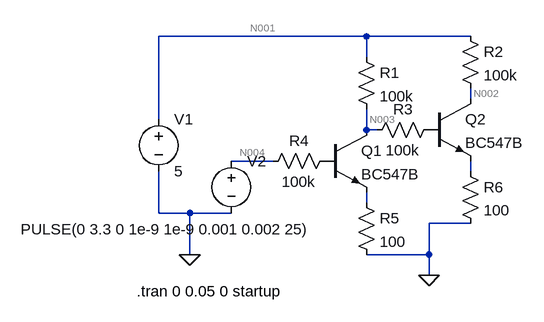
[diagram p0: schematic 3V3_to_5V_Converter_NPN_BJT.asc]
3V3_to_5V_Converter_NPN_BJT.asc, the LTspice schematic file:
Version 4
SHEET 1 880 680
WIRE 176 -16 -144 -16
WIRE 336 -16 176 -16
WIRE 176 16 176 -16
WIRE 336 80 336 64
WIRE -144 112 -144 -16
WIRE 176 128 176 96
WIRE 192 128 176 128
WIRE 32 176 -32 176
WIRE 336 192 336 176
WIRE 176 240 176 224
WIRE -144 256 -144 192
WIRE -96 256 -144 256
WIRE -32 256 -96 256
WIRE 336 272 272 272
WIRE -96 320 -96 256
WIRE 272 320 272 272
WIRE 272 320 176 320
WIRE 272 352 272 320
FLAG 272 352 0
FLAG -96 320 0
SYMBOL npn 112 128 R0
SYMATTR InstName Q1
SYMATTR Value BC547B
SYMBOL res 160 0 R0
SYMATTR InstName R1
SYMATTR Value 100k
SYMBOL res 320 -32 R0
SYMATTR InstName R2
SYMATTR Value 100k
SYMBOL res 288 112 R90
WINDOW 0 0 56 VBottom 2
WINDOW 3 32 56 VTop 2
SYMATTR InstName R3
SYMATTR Value 100k
SYMBOL res 128 160 R90
WINDOW 0 0 56 VBottom 2
WINDOW 3 32 56 VTop 2
SYMATTR InstName R4
SYMATTR Value 100k
SYMBOL res 160 224 R0
SYMATTR InstName R5
SYMATTR Value 100
SYMBOL res 320 176 R0
SYMATTR InstName R6
SYMATTR Value 100
SYMBOL voltage -144 96 R0
WINDOW 123 0 0 Left 0
WINDOW 39 0 0 Left 0
SYMATTR InstName V1
SYMATTR Value 5
SYMBOL voltage -32 160 R0
WINDOW 3 -324 121 Left 2
WINDOW 123 0 0 Left 0
WINDOW 39 0 0 Left 0
SYMATTR InstName V2
SYMATTR Value PULSE(0 3.3 0 1e-9 1e-9 0.001 0.002 25)
SYMBOL npn 272 80 R0
SYMATTR InstName Q2
SYMATTR Value BC547B
TEXT -178 376 Left 2 !.tran 0 0.05 0 startup

The netlist it stands for:
* 3V3_to_5V_Converter_NPN_BJT.asc
Q1 N003 P001 N006 0 BC547B
R1 N001 N003 100k
R2 N001 N002 100k
R3 P002 N003 100k
R4 P001 N004 100k
R5 N006 0 100
R6 N005 0 100
V1 N001 0 5
V2 N004 0 PULSE(0 3.3 0 1e-9 1e-9 0.001 0.002 25)
Q2 N002 P002 N005 0 BC547B
.model NPN NPN
.model PNP PNP
.lib standard.bjt
.tran 0 0.05 0 startup
.backanno
.end

* Results of the author's LTspice run, read from the files saved beside the schematic
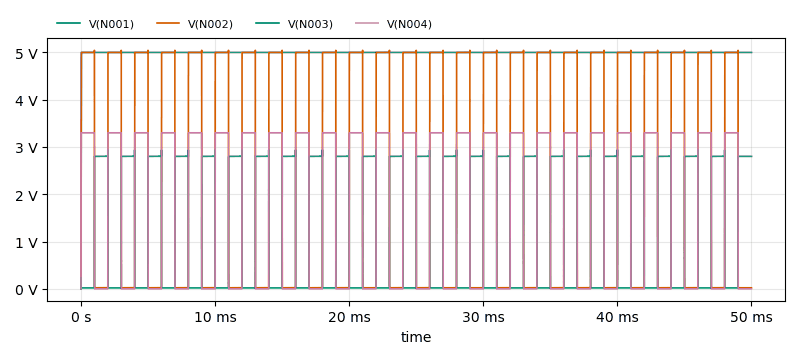
[diagram p1: Transient Analysis of 3V3_to_5V_Converter_NPN_BJT.asc, plotted from the saved traces]
* Transient Analysis, 1 run:
*   V(N001): min 0 V, max 5 V, average 4.999 V, rms 4.999 V, last 5 V
*   V(N002): min 0 V, max 5.044 V, average 2.509 V, rms 3.533 V, last 21.12 mV
*   V(N003): min 0 V, max 2.937 V, average 1.409 V, rms 1.98 V, last 2.802 V
*   V(N004): min 0 V, max 3.3 V, average 1.65 V, rms 2.333 V, last 0 V